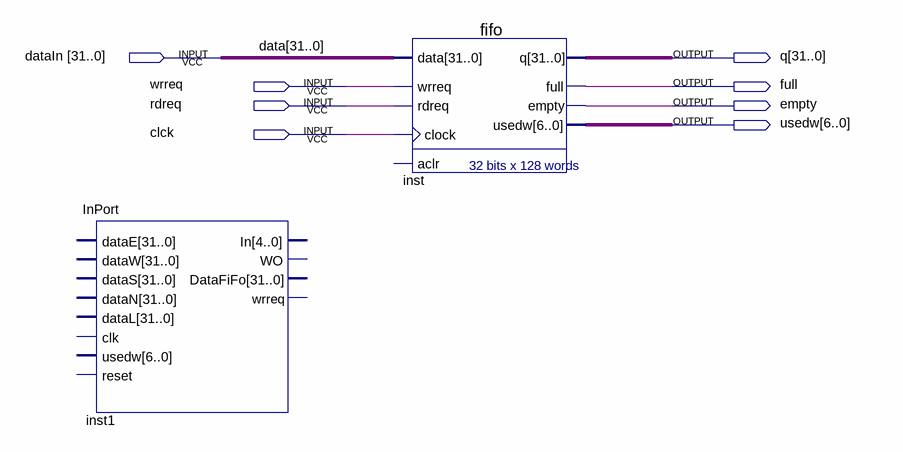
[diagram p0: schematic sheet]
// Quartus schematic NoCSimp_.bdf as structural Verilog: 2 symbols, 8 pins
module NoCSimp_ (
  input  [31:0] dataIn,
  input  wrreq,
  input  rdreq,
  input  clck,
  output [31:0] q,
  output full,
  output empty,
  output [6:0] usedw
);

  InPort inst1 ();  // open: dataE, dataW, dataS, dataN, dataL, clk, usedw, reset, WO, DataFiFo, wrreq, In
  fifo inst (
    .data(dataIn), .wrreq(wrreq), .rdreq(rdreq), .clock(clck), .q(q), .full(full), .empty(empty),
    .usedw(usedw));  // open: aclr

  // Other names for the same wires on the sheet: data[31:0] = dataIn
endmodule
